# Altium schematic sheet Page H_B2B_A.SchDoc
size 386 x 246 mm; SheetNumber: 0; SheetTotal: 0
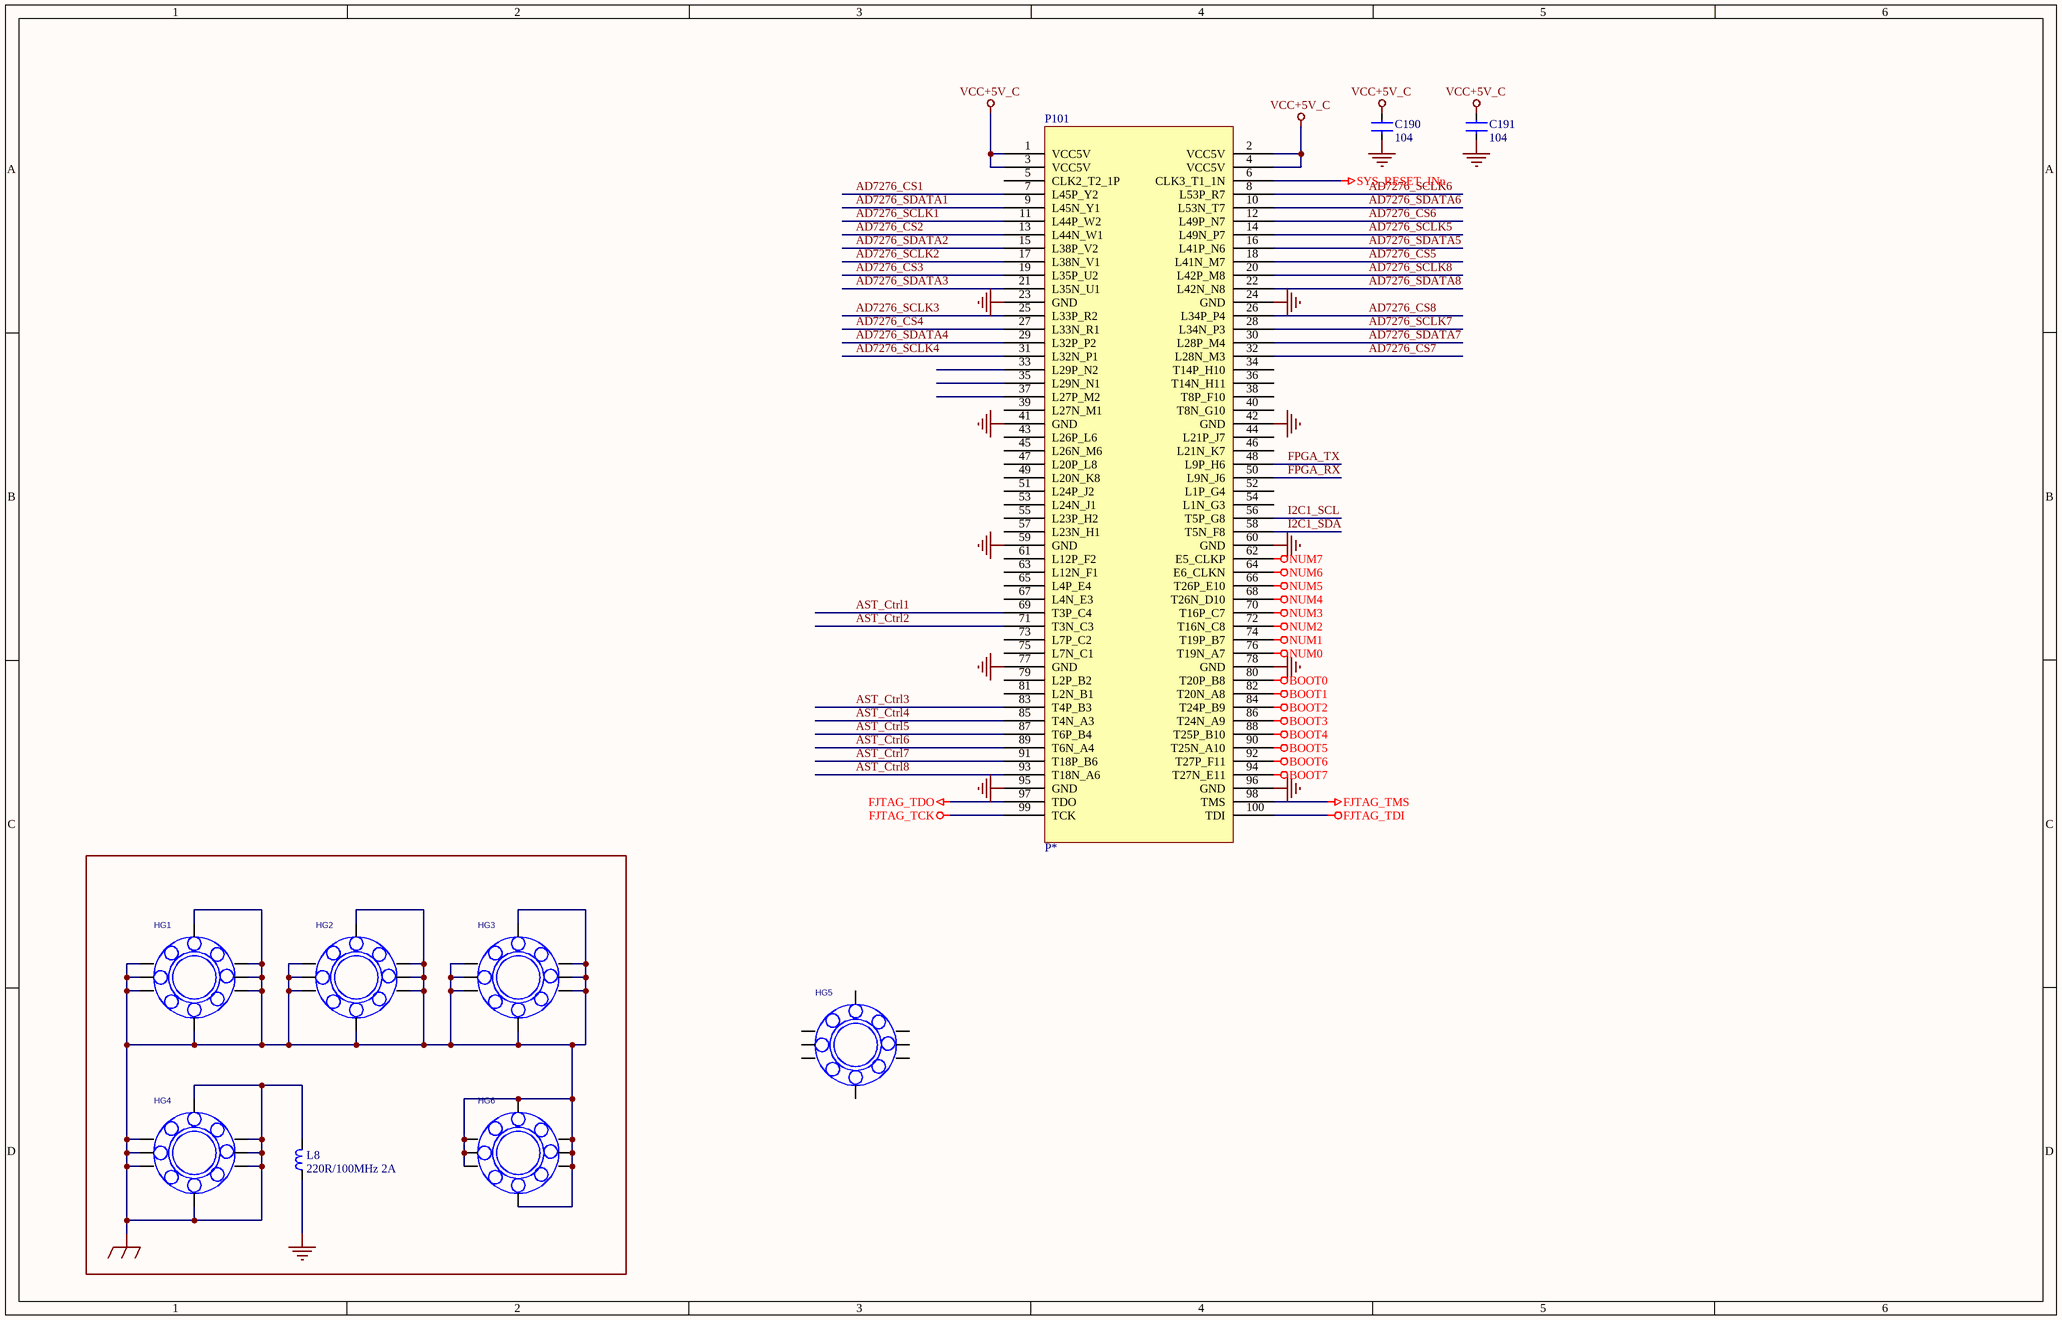
[diagram p0: Page H_B2B_A.SchDoc]

## Parts
C190  104  [0603C]
C191  104  [0603C]
HG1  MOUNTING_HOLE_NL  [th126_196c_13c]  (value not drawn)
HG2  MOUNTING_HOLE_NL  [th126_196c_13c]  (value not drawn)
HG3  MOUNTING_HOLE_NL  [th126_196c_13c]  (value not drawn)
HG4  MOUNTING_HOLE_NL  [th126_196c_13c]  (value not drawn)
HG5  MOUNTING_HOLE_NL  [th126_196c_13c]  (value not drawn)
HG6  MOUNTING_HOLE_NL  [th126_196c_13c]  (value not drawn)
L8  220R/100MHz 2A  [0603R]
P101  P*  [IDC100-05MM-SMD]

## Nets
BOOT0: P101.80(T20P_B8)
BOOT1: P101.82(T20N_A8)
BOOT2: P101.84(T24P_B9)
BOOT3: P101.86(T24N_A9)
BOOT4: P101.88(T25P_B10)
BOOT5: P101.90(T25N_A10)
BOOT6: P101.92(T27P_F11)
BOOT7: P101.94(T27N_E11)
FJTAG_TCK: P101.99(TCK)
FJTAG_TDI: P101.100(TDI)
FJTAG_TDO: P101.97(TDO)
FJTAG_TMS: P101.98(TMS)
GND: C190.1 C191.1 L8.1 P101.23(GND) P101.24(GND) P101.41(GND) P101.42(GND) P101.59(GND) P101.60(GND) P101.77(GND) P101.78(GND) P101.95(GND) P101.96(GND)
GND_EARTH: HG1.1(G1) HG1.2(G2) HG1.3(G3) HG1.4(G4) HG1.5(G5) HG1.6(G6) HG1.7(G7) HG1.8(G8) HG2.1(G1) HG2.2(G2) HG2.3(G3) HG2.4(G4) HG2.5(G5) HG2.6(G6) HG2.7(G7) HG2.8(G8) HG3.1(G1) HG3.2(G2) HG3.3(G3) HG3.4(G4) HG3.5(G5) HG3.6(G6) HG3.7(G7) HG3.8(G8) HG4.1(G1) HG4.2(G2) HG4.3(G3) HG4.4(G4) HG4.5(G5) HG4.6(G6) HG4.7(G7) HG4.8(G8) HG6.1(G1) HG6.2(G2) HG6.3(G3) HG6.4(G4) HG6.5(G5) HG6.6(G6) HG6.7(G7) HG6.8(G8) L8.2
NUM0: P101.76(T19N_A7)
NUM1: P101.74(T19P_B7)
NUM2: P101.72(T16N_C8)
NUM3: P101.70(T16P_C7)
NUM4: P101.68(T26N_D10)
NUM5: P101.66(T26P_E10)
NUM6: P101.64(E6_CLKN)
NUM7: P101.62(E5_CLKP)
SYS_RESET_INn: P101.6(CLK3_T1_1N)
VCC+5V_C: C190.2 C191.2 P101.1(VCC5V) P101.2(VCC5V) P101.3(VCC5V) P101.4(VCC5V)
AD7276_CS1: P101.7(L45P_Y2)
AD7276_CS2: P101.13(L44N_W1)
AD7276_CS3: P101.19(L35P_U2)
AD7276_CS4: P101.27(L33N_R1)
AD7276_CS5: P101.18(L41N_M7)
AD7276_CS6: P101.12(L49P_N7)
AD7276_CS7: P101.32(L28N_M3)
AD7276_CS8: P101.26(L34P_P4)
AD7276_SCLK1: P101.11(L44P_W2)
AD7276_SCLK2: P101.17(L38N_V1)
AD7276_SCLK3: P101.25(L33P_R2)
AD7276_SCLK4: P101.31(L32N_P1)
AD7276_SCLK5: P101.14(L49N_P7)
AD7276_SCLK6: P101.8(L53P_R7)
AD7276_SCLK7: P101.28(L34N_P3)
AD7276_SCLK8: P101.20(L42P_M8)
AD7276_SDATA1: P101.9(L45N_Y1)
AD7276_SDATA2: P101.15(L38P_V2)
AD7276_SDATA3: P101.21(L35N_U1)
AD7276_SDATA4: P101.29(L32P_P2)
AD7276_SDATA5: P101.16(L41P_N6)
AD7276_SDATA6: P101.10(L53N_T7)
AD7276_SDATA7: P101.30(L28P_M4)
AD7276_SDATA8: P101.22(L42N_N8)
AST_Ctrl1: P101.69(T3P_C4)
AST_Ctrl2: P101.71(T3N_C3)
AST_Ctrl3: P101.83(T4P_B3)
AST_Ctrl4: P101.85(T4N_A3)
AST_Ctrl5: P101.87(T6P_B4)
AST_Ctrl6: P101.89(T6N_A4)
AST_Ctrl7: P101.91(T18P_B6)
AST_Ctrl8: P101.93(T18N_A6)
FPGA_RX: P101.50(L9N_J6)
FPGA_TX: P101.48(L9P_H6)
I2C1_SCL: P101.56(T5P_G8)
I2C1_SDA: P101.58(T5N_F8)

Not connected (* = marked no-connect by the designer): HG5 1(G1) 2(G2) 3(G3) 4(G4) 5(G5) 6(G6) 7(G7) 8(G8); P101 5(CLK2_T2_1P) 33(L29P_N2) 34(T14P_H10) 35(L29N_N1) 36(T14N_H11) 37(L27P_M2) 38(T8P_F10) 39(L27N_M1) 40(T8N_G10) 43(L26P_L6) 44(L21P_J7) 45(L26N_M6) 46(L21N_K7) 47(L20P_L8) 49(L20N_K8) 51(L24P_J2) 52(L1P_G4) 53(L24N_J1) 54(L1N_G3) 55(L23P_H2) 57(L23N_H1) 61(L12P_F2) 63(L12N_F1) 65(L4P_E4) 67(L4N_E3) 73(L7P_C2) 75(L7N_C1) 79(L2P_B2) 81(L2N_B1)

## Library data of the parts
C190 C191 = C-X5R/X7R
HG1-HG6 = MOUNTING_HOLE: Sym, PCB mounting holes, th126_196c_13c; Install: No; Remark: 孔
L8 = Inductor
P101 = IDC100